# Altium schematic sheet tcrt_mux.SchDoc
size A4
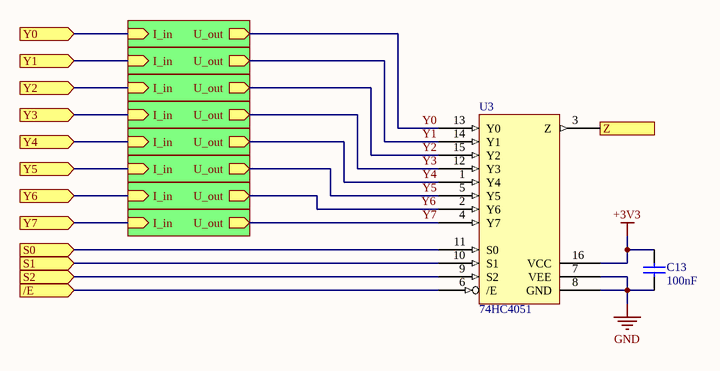
[diagram p0: tcrt_mux.SchDoc]

## Parts
C13  100nF  [FP_0805_CAP_085]
U3  74HC4051  [SOP16]

## Sub-sheets
U_tcrt5000 = tcrt5000.SchDoc: I_in (in), U_out (out)
U_tcrt5000 = tcrt5000.SchDoc: I_in (in), U_out (out)
U_tcrt5000 = tcrt5000.SchDoc: I_in (in), U_out (out)
U_tcrt5000 = tcrt5000.SchDoc: I_in (in), U_out (out)
U_tcrt5000 = tcrt5000.SchDoc: I_in (in), U_out (out)
U_tcrt5000 = tcrt5000.SchDoc: I_in (in), U_out (out)
U_tcrt5000 = tcrt5000.SchDoc: I_in (in), U_out (out)
U_tcrt5000 = tcrt5000.SchDoc: I_in (in), U_out (out)

## Ports
/E (in), S0 (in), S1 (in), S2 (in), Y0 (in), Y1 (in), Y2 (in), Y3 (in), Y4 (in), Y5 (in), Y6 (in), Y7 (in), Z (out)

## Nets
+3V3: C13.2 U3.16(VCC)
GND: C13.1 U3.7(VEE) U3.8(GND)
/E: U3.6(/E) ; port /E
S0: U3.11(S0) ; port S0
S1: U3.10(S1) ; port S1
S2: U3.9(S2) ; port S2
Y0: U3.13(Y0) ; sheet U_tcrt5000/U_out
Y0: port Y0, sheet U_tcrt5000/I_in  [a separate net that carries the same name]
Y1: U3.14(Y1) ; sheet U_tcrt5000/U_out
Y1: port Y1, sheet U_tcrt5000/I_in  [a separate net that carries the same name]
Y2: U3.15(Y2) ; sheet U_tcrt5000/U_out
Y2: port Y2, sheet U_tcrt5000/I_in  [a separate net that carries the same name]
Y3: U3.12(Y3) ; sheet U_tcrt5000/U_out
Y3: port Y3, sheet U_tcrt5000/I_in  [a separate net that carries the same name]
Y4: U3.1(Y4) ; sheet U_tcrt5000/U_out
Y4: port Y4, sheet U_tcrt5000/I_in  [a separate net that carries the same name]
Y5: U3.5(Y5) ; sheet U_tcrt5000/U_out
Y5: port Y5, sheet U_tcrt5000/I_in  [a separate net that carries the same name]
Y6: U3.2(Y6) ; sheet U_tcrt5000/U_out
Y6: port Y6, sheet U_tcrt5000/I_in  [a separate net that carries the same name]
Y7: U3.4(Y7) ; sheet U_tcrt5000/U_out
Y7: port Y7, sheet U_tcrt5000/I_in  [a separate net that carries the same name]
Z: U3.3(Z) ; port Z

## Library data of the parts
C13 = CAP 100nF: Capacitor; Voltage: 50V; Reference: 2407344; Supplier: Farnell; Value: 100nF
U3 = 74HC4051: Analog multiplexer; Reference: 2445304; Supplier: Farnell